# EAGLE design etch (EAGLE 9.6.2)
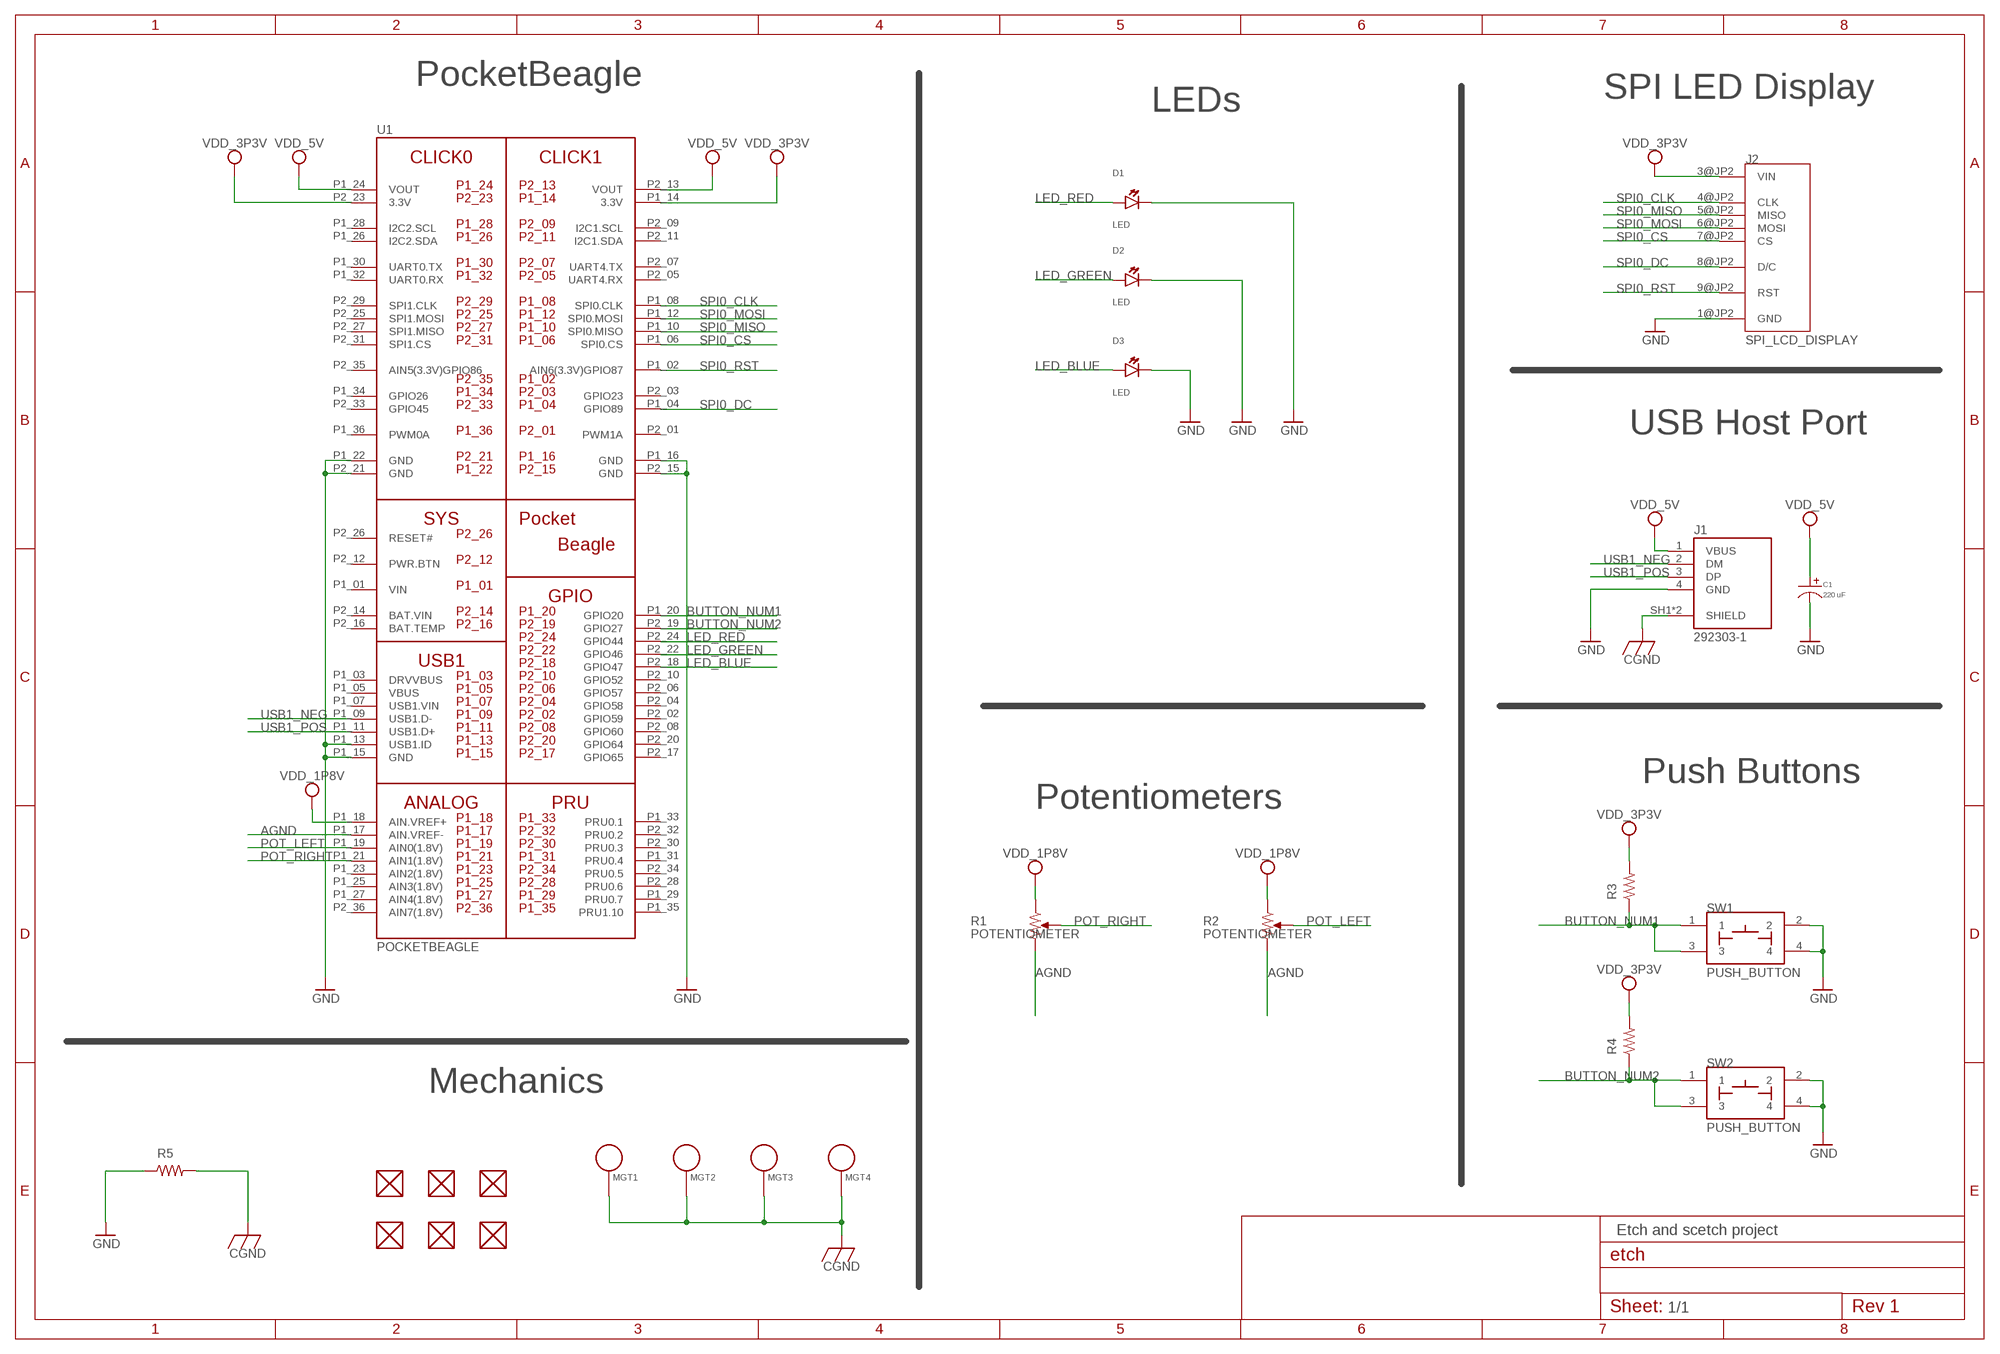
[diagram p0: schematic, sheet 1]

## Parts
C1  220 uF  CAPACITOR_P_10MM  [CP10MM]
D1  LED  [EIA-STD]
D2  LED  [EIA-STD]
D3  LED  [EIA-STD]
FUD1  FIDUCIAL  [FIDUCIAL_40MIL]
FUD2  FIDUCIAL  [FIDUCIAL_40MIL]
FUD3  FIDUCIAL  [FIDUCIAL_40MIL]
FUD4  FIDUCIAL  [FIDUCIAL_40MIL]
FUD5  FIDUCIAL  [FIDUCIAL_40MIL]
FUD6  FIDUCIAL  [FIDUCIAL_40MIL]
J1  292303-1  [TE_292303-1]
J2  SPI_LCD_DISPLAY  [TFT_LCD_PCB]
MGT1  MOUNTING_HOLE  [MOUNTING_HOLE]
MGT2  MOUNTING_HOLE  [MOUNTING_HOLE]
MGT3  MOUNTING_HOLE  [MOUNTING_HOLE]
MGT4  MOUNTING_HOLE  [MOUNTING_HOLE]
R1  POTENTIOMETER  [POT-PO90S]
R2  POTENTIOMETER  [POT-PO90S]
R3  R_R0603  [R0603]
R4  R_R0603  [R0603]
R5  R_R0603  [R0603]
SW1  PUSH_BUTTON  [BUTTON_12.5MM]
SW2  PUSH_BUTTON  [BUTTON_12.5MM]
U1  POCKETBEAGLE  [POCKETBEAGLE]

## Nets
AGND: R1.CW R2.CW U1.P1_17(AIN.VREF-)
BUTTON_NUM1: R3.1 SW1.1 SW1.3 U1.P1_20(GPIO20)
BUTTON_NUM2: R4.1 SW2.1 SW2.3 U1.P2_19(GPIO27)
CGND: J1.SH1(SHIELD) J1.SH2(SHIELD) MGT1.P$1 MGT2.P$1 MGT3.P$1 MGT4.P$1 R5.2
GND: C1.P$2 D1.CATHODE D2.CATHODE D3.CATHODE J1.4(GND) J2.1@JP2(GND) R5.1 SW1.2 SW1.4 SW2.2 SW2.4 U1.P1_13(USB1.ID) U1.P1_15(GND) U1.P1_16(GND) U1.P1_22(GND) U1.P2_15(GND) U1.P2_21(GND)
LED_BLUE: D3.ANODE U1.P2_18(GPIO47)
LED_GREEN: D2.ANODE U1.P2_22(GPIO46)
LED_RED: D1.ANODE U1.P2_24(GPIO44)
POT_LEFT: R2.S U1.P1_19(AIN0(1.8V))
POT_RIGHT: R1.S U1.P1_21(AIN1(1.8V))
SPI0_CLK: J2.4@JP2(CLK) U1.P1_08(SPI0.CLK)
SPI0_CS: J2.7@JP2(CS) U1.P1_06(SPI0.CS)
SPI0_DC: J2.8@JP2(D/C) U1.P1_04(GPIO89)
SPI0_MISO: J2.5@JP2(MISO) U1.P1_10(SPI0.MISO)
SPI0_MOSI: J2.6@JP2(MOSI) U1.P1_12(SPI0.MOSI)
SPI0_RST: J2.9@JP2(RST) U1.P1_02(AIN6(3.3V)GPIO87)
USB1_NEG: J1.2(DM) U1.P1_09(USB1.D-)
USB1_POS: J1.3(DP) U1.P1_11(USB1.D+)
VDD_1P8V: R1.CCW R2.CCW U1.P1_18(AIN.VREF+)
VDD_3P3V: J2.3@JP2(VIN) R3.2 R4.2 U1.P1_14(3.3V) U1.P2_23(3.3V)
VDD_5V: C1.P$1 J1.1(VBUS) U1.P1_24(VOUT) U1.P2_13(VOUT)
Unconnected: FUD1.P$1 FUD2.P$1 FUD3.P$1 FUD4.P$1 FUD5.P$1 FUD6.P$1 U1.P1_03(DRVVBUS) U1.P1_05(VBUS) U1.P1_07(USB1.VIN) U1.P1_23(AIN2(1.8V)) U1.P1_25(AIN3(1.8V)) U1.P1_26(I2C2.SDA) U1.P1_27(AIN4(1.8V)) U1.P1_28(I2C2.SCL) U1.P1_29(PRU0.7) U1.P1_30(UART0.TX) U1.P1_31(PRU0.4) U1.P1_32(UART0.RX) U1.P1_33(PRU0.1) U1.P1_34(GPIO26) U1.P1_35(PRU1.10) U1.P1_36(PWM0A) U1.P2_01(PWM1A) U1.P2_02(GPIO59) U1.P2_03(GPIO23) U1.P2_04(GPIO58) U1.P2_05(UART4.RX) U1.P2_06(GPIO57) U1.P2_07(UART4.TX) U1.P2_08(GPIO60) U1.P2_09(I2C1.SCL) U1.P2_10(GPIO52) U1.P2_11(I2C1.SDA) U1.P2_12(PWR.BTN) U1.P2_16(BAT.TEMP) U1.P2_17(GPIO65) U1.P2_20(GPIO64) U1.P2_25(SPI1.MOSI) U1.P2_26(RESET#) U1.P2_27(SPI1.MISO) U1.P2_28(PRU0.6) U1.P2_29(SPI1.CLK) U1.P2_30(PRU0.3) U1.P2_31(SPI1.CS) U1.P2_32(PRU0.2) U1.P2_33(GPIO45) U1.P2_34(PRU0.5) U1.P2_35(AIN5(3.3V)GPIO86) U1.P2_36(AIN7(1.8V))

## Notes on the sheet
- PocketBeagle
- SPI LED Display
- LEDs
- USB Host Port
- Push Buttons
- Potentiometers
- Mechanics
- Etch and scetch project
- 1/1

## Power pins joined to a net without a drawn wire
BAT.VIN: U1.P2_14(BAT.VIN)
VIN: U1.P1_01(VIN)

## Library data of the parts
C1 = etchpre:CAPACITOR_P: Library: MF_Passives Description: Device for Polarized Capacitors. Manufacture part number (MPN), Voltage Rating, and Tolerance can be added via Attributes. Check https://factory.macrofab.com/parts for the house parts list.; POPULATE: 1
D1-D3 = etchpre:LED: EIA-STD LED, LTST-C191TBKT
FUD1-FUD6 = etchpre:FIDUCIAL
J1 = etchpre:292303-1: CONN USB RECEPT R/A TYPE A 4POS Check availability <https://pricing.snapeda.com/parts/292303-1/TE%20Connectivity/view-part?ref=eda>; AVAILABILITY: In Stock; CENTERLINE_PITCH: 2 mm[.078 in]; COMMENT: 292303-1; DESCRIPTION: Conn; Data; USB; Recept; 2.0; 4 Pos; 1 Port; Rt Angle; A Ser; Tin over Copper; EU_ROHS_COMPLIANCE: Compliant; MF: TE Connectivity; MP: 292303-1; NUMBER_OF_POSITIONS: 4; PACKAGE: None; PRICE: None; PRODUCT_TYPE: Connector; PURCHASE-URL: https://pricing.snapeda.com/search/part/292303-1/?ref=eda
J2 = etchpre:SPI_LCD_DISPLAY
MGT1-MGT4 = etchpre:MOUNTING_HOLE: Chassis Mounting Hole w/GND connection ability
R1 R2 = etchpre:POTENTIOMETER: Potentiometer - Examples: P090S-14T20BR10K (987-1277-ND)
R3-R5 = etchpre:R_: RESISTOR, American symbol
SW1 SW2 = etchpre:PUSH_BUTTON
U1 = etchpre:POCKETBEAGLE

## Board
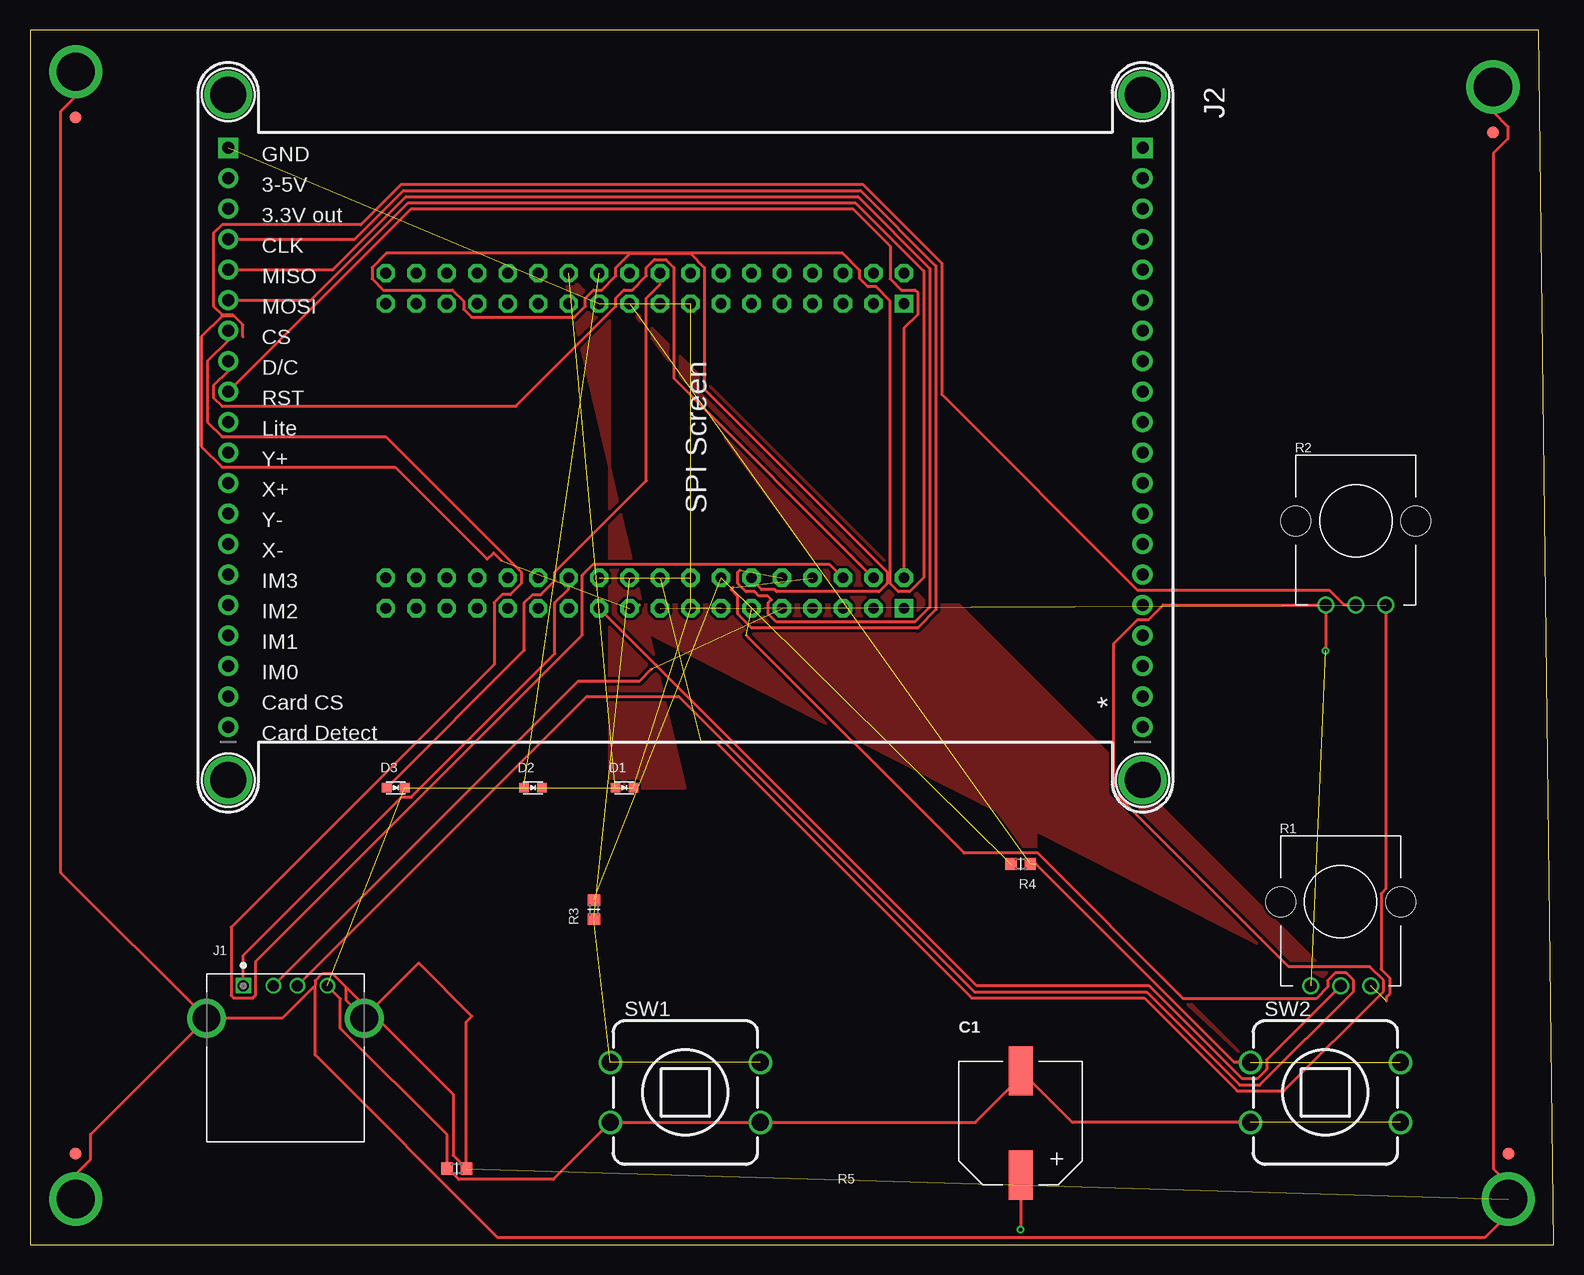
[diagram p1: board, top side]
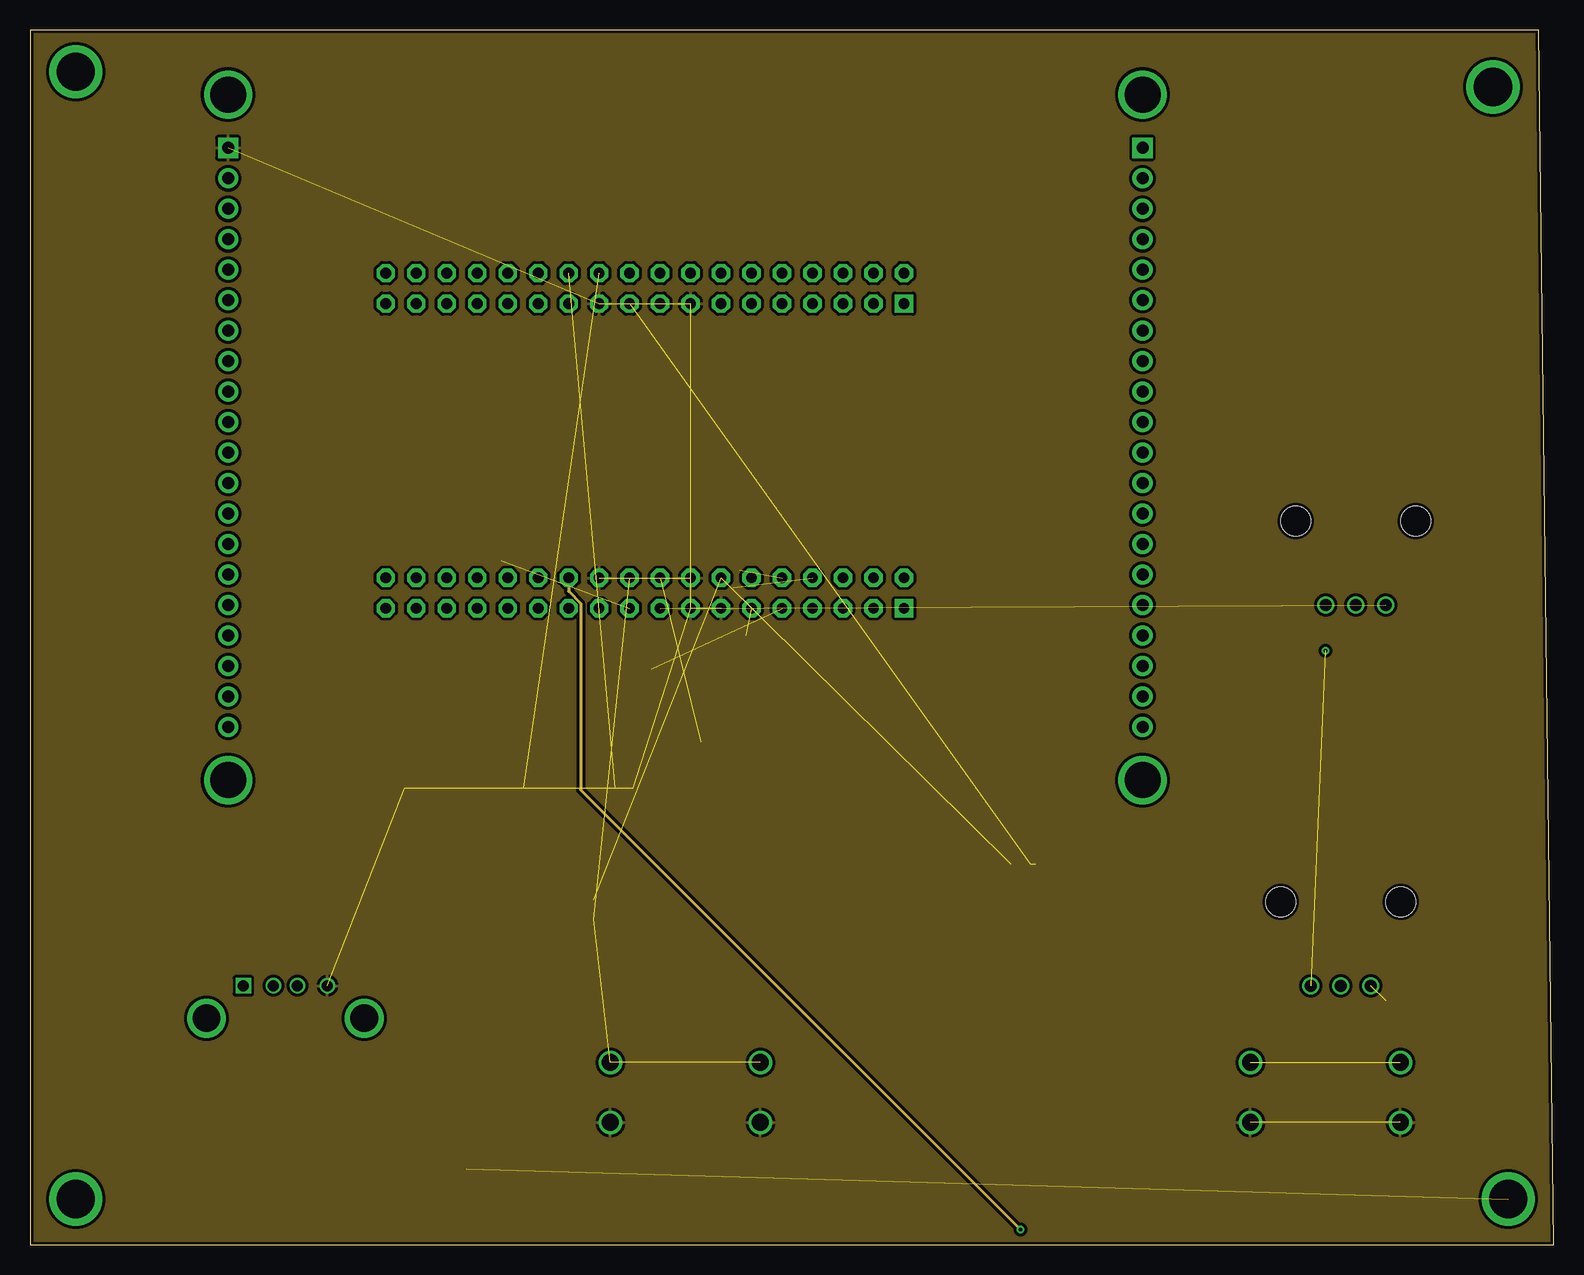
[diagram p2: board, inner layer Route2]
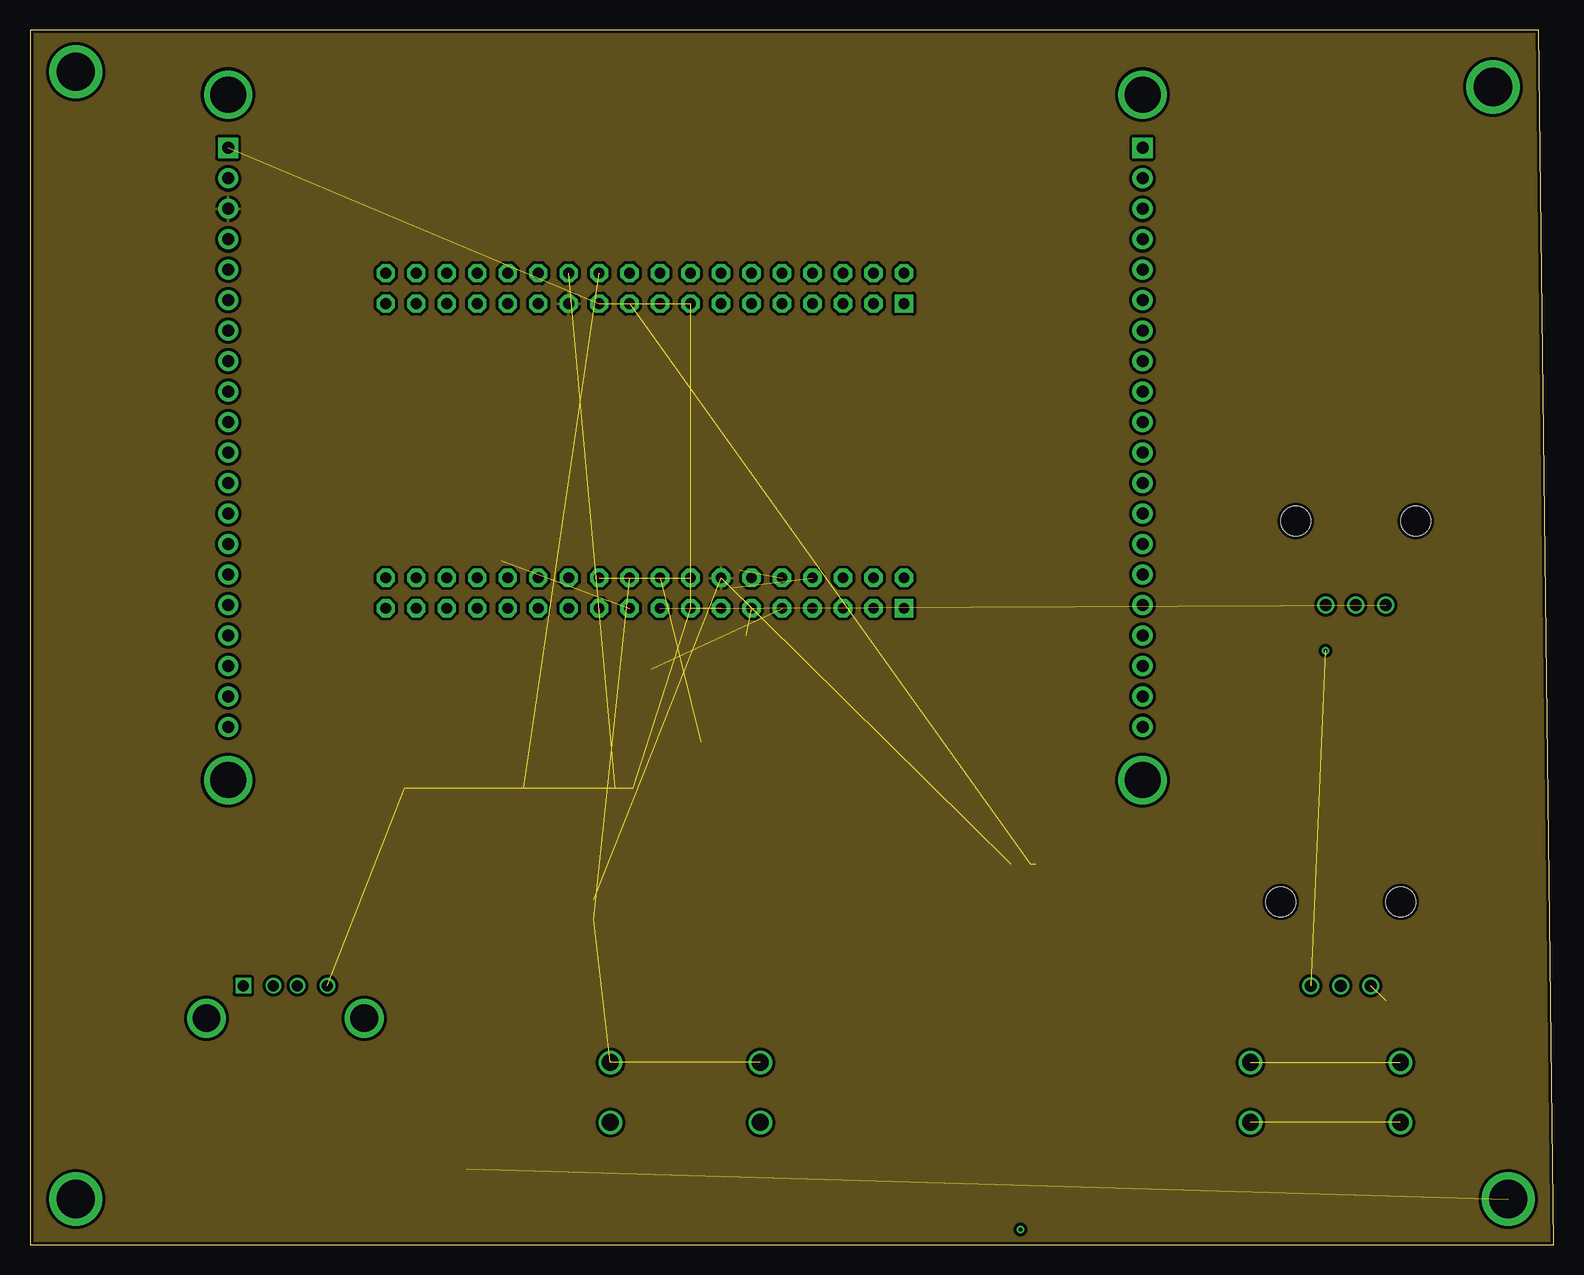
[diagram p3: board, inner layer Route15]
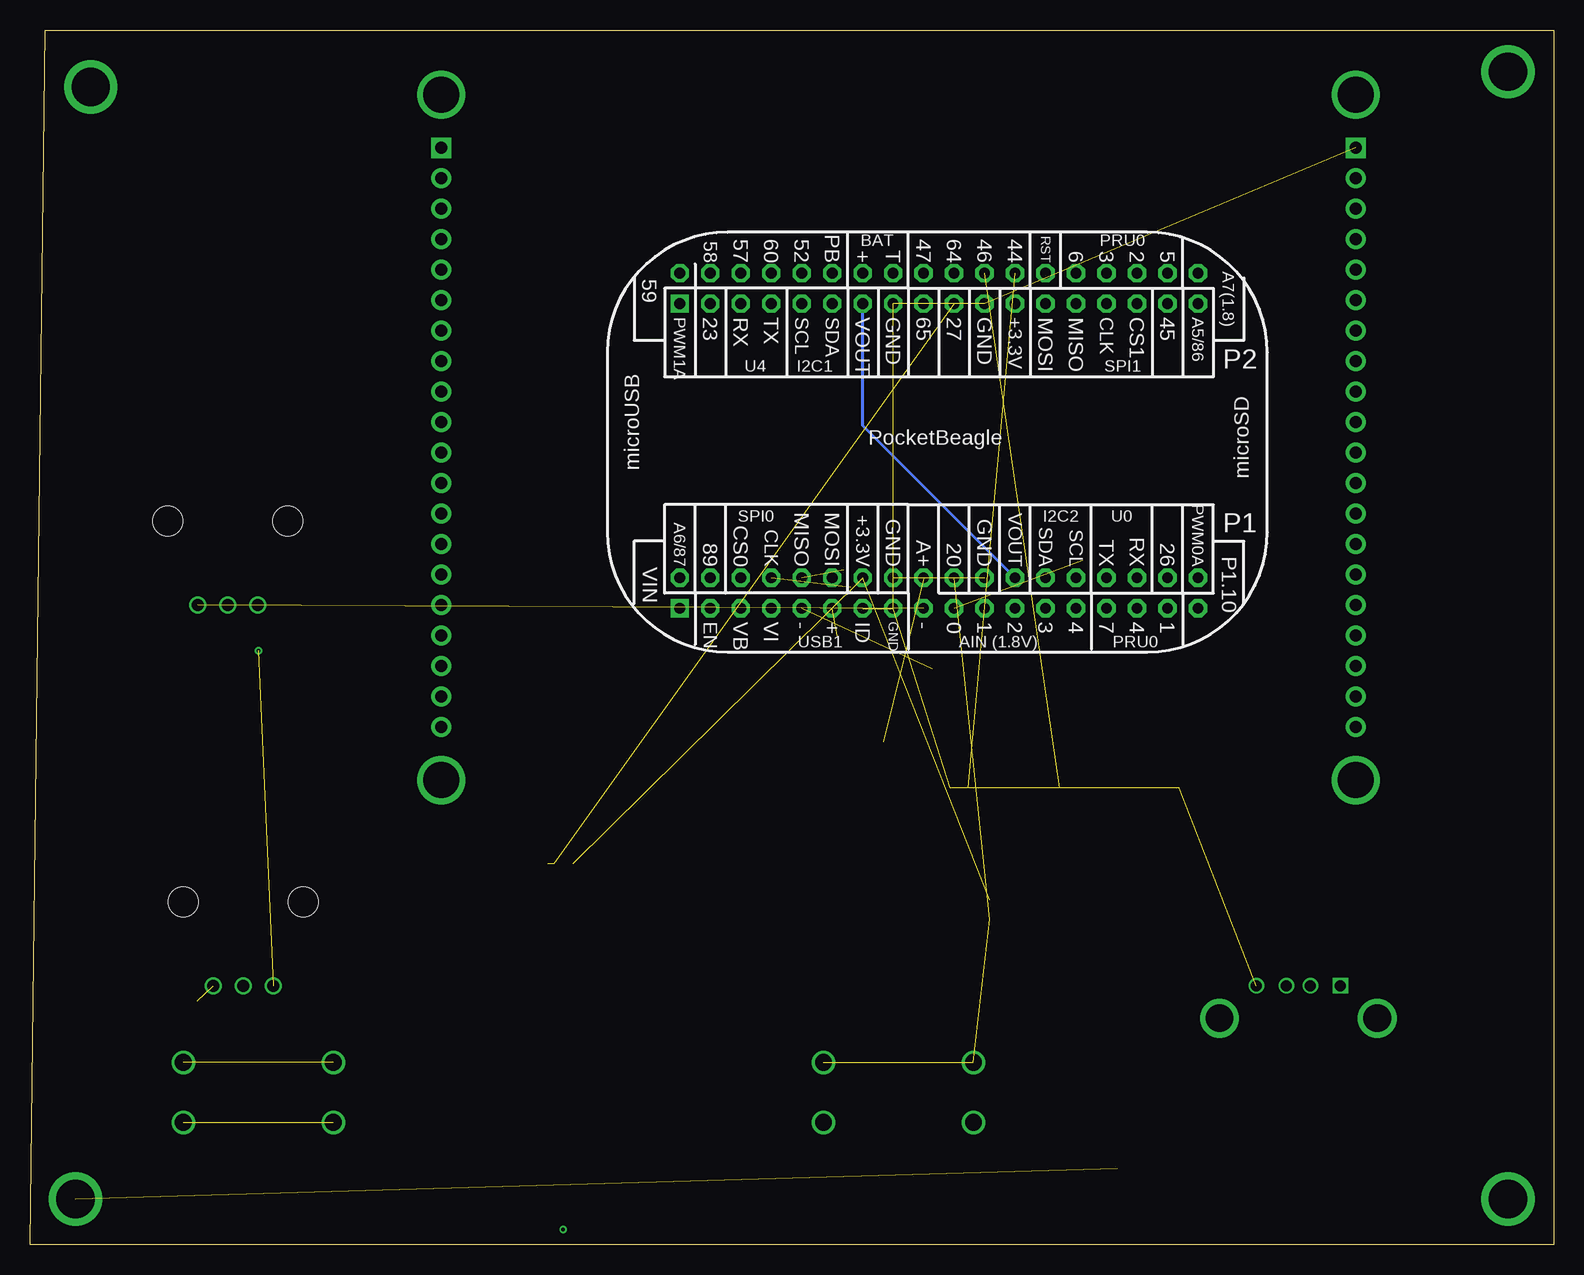
[diagram p4: board, bottom side, seen from below]

Size 126.98 x 101.27 mm. Coordinates in mm from the lower left corner, seen from the top.
Outline: 0,0 126.98,0 125.71,101.27 0,101.27 0,0
Copper layers (1*2*15*16): Top 0.035mm / dielectric 0.23mm / Route2 0.035mm / dielectric 0.93mm / Route15 0.035mm / dielectric 0.23mm / Bottom 0.035mm
Design rules "4layer": minimum track width 10mil, minimum drill 12mil, track to track 10mil, track to pad 10mil, pad to pad 10mil, via to via 10mil, smd to smd 10mil, copper to edge 10mil, drill to drill 12mil, minimum pad ring 6mil, minimum via ring 6mil, stop-mask expansion 3mil, vias tented up to drill 25mil, thermal gap 10mil

### Footprints (pad centres in the part's own frame; a part is rotated, then mirrored left to right if it is on the bottom)
CP10MM = smd 2 x 4.1: P$1 0,-4.35; P$2 0,4.35
EIA-STD = smd 0.8 x 0.8: ANODE -0.75,0; CATHODE 0.75,0
FIDUCIAL_40MIL = smd 1.016 x 1.016: P$1 0,0
TE_292303-1 = drill 0.92 square: 1 0,0 | drill 0.92: 2 2.5,0; 3 4.5,0; 4 7,0 | drill 2.3: SH1 -3.07,-2.71; SH2 10.07,-2.71
TFT_LCD_PCB = drill 1 pad 1.676 square: 1@JP1 -24.13,38.1; 1@JP2 -24.13,-38.1 | drill 1 pad 1.676: 2@JP1 -21.59,38.1; 2@JP2 -21.59,-38.1; 3@JP1 -19.05,38.1; 3@JP2 -19.05,-38.1; 4@JP1 -16.51,38.1; 4@JP2 -16.51,-38.1; 5@JP1 -13.97,38.1; 5@JP2 -13.97,-38.1; 6@JP1 -11.43,38.1; 6@JP2 -11.43,-38.1; 7@JP1 -8.89,38.1; 7@JP2 -8.89,-38.1; 8@JP1 -6.35,38.1; 8@JP2 -6.35,-38.1; 9@JP1 -3.81,38.1; 9@JP2 -3.81,-38.1; 10@JP1 -1.27,38.1; 10@JP2 -1.27,-38.1; 11@JP1 1.27,38.1; 11@JP2 1.27,-38.1; 12@JP1 3.81,38.1; 12@JP2 3.81,-38.1; 13@JP1 6.35,38.1; 13@JP2 6.35,-38.1; 14@JP1 8.89,38.1; 14@JP2 8.89,-38.1; 15@JP1 11.43,38.1; 15@JP2 11.43,-38.1; 16@JP1 13.97,38.1; 16@JP2 13.97,-38.1; 17@JP1 16.51,38.1; 17@JP2 16.51,-38.1; 18@JP1 19.05,38.1; 18@JP2 19.05,-38.1; 19@JP1 21.59,38.1; 19@JP2 21.59,-38.1; 20@JP1 24.13,38.1; 20@JP2 24.13,-38.1 | drill 3 pad 3.6: P$1@U$7 -28.575,-38.1; P$1@U$15 28.575,-38.1; P$1@U$16 -28.575,38.1; P$1@U$17 28.575,38.1
MOUNTING_HOLE = drill 3.175 pad 4.445: P$1 0,0
POT-PO90S = drill 1: CCW -2.5,0; CW 2.5,0; S 0,0 | hole 2.5: -5,7; 5,7
R0603 = smd 0.95 x 1.031: 1 -0.8,0; 2 0.8,0
BUTTON_12.5MM = drill 1.4: 1 -6.25,2.5; 2 -6.25,-2.5; 3 6.25,2.5; 4 6.25,-2.5
POCKETBEAGLE = drill 0.889 pad 1.524 square: P1_01 5.91,3.53; P2_01 5.91,28.93 | drill 0.889 pad 1.524 octagon: P1_02 5.91,6.07; P1_03 8.45,3.53; P1_04 8.45,6.07; P1_05 10.99,3.53; P1_06 10.99,6.07; P1_07 13.53,3.53; P1_08 13.53,6.07; P1_09 16.07,3.53; P1_10 16.07,6.07; P1_11 18.61,3.53; P1_12 18.61,6.07; P1_13 21.15,3.53; P1_14 21.15,6.07; P1_15 23.69,3.53; P1_16 23.69,6.07; P1_17 26.23,3.53; P1_18 26.23,6.07; P1_19 28.77,3.53; P1_20 28.77,6.07; P1_21 31.31,3.53; P1_22 31.31,6.07; P1_23 33.85,3.53; P1_24 33.85,6.07; P1_25 36.39,3.53; P1_26 36.39,6.07; P1_27 38.93,3.53; P1_28 38.93,6.07; P1_29 41.47,3.53; P1_30 41.47,6.07; P1_31 44.01,3.53; P1_32 44.01,6.07; P1_33 46.55,3.53; P1_34 46.55,6.07; P1_35 49.09,3.53; P1_36 49.09,6.07; P2_02 5.91,31.47; P2_03 8.45,28.93; P2_04 8.45,31.47; P2_05 10.99,28.93; P2_06 10.99,31.47; P2_07 13.53,28.93; P2_08 13.53,31.47; P2_09 16.07,28.93; P2_10 16.07,31.47; P2_11 18.61,28.93; P2_12 18.61,31.47; P2_13 21.15,28.93; P2_14 21.15,31.47; P2_15 23.69,28.93; P2_16 23.69,31.47; P2_17 26.23,28.93; P2_18 26.23,31.47; P2_19 28.77,28.93; P2_20 28.77,31.47; P2_21 31.31,28.93; P2_22 31.31,31.47; P2_23 33.85,28.93; P2_24 33.85,31.47; P2_25 36.39,28.93; P2_26 36.39,31.47; P2_27 38.93,28.93; P2_28 38.93,31.47; P2_29 41.47,28.93; P2_30 41.47,31.47; P2_31 44.01,28.93; P2_32 44.01,31.47; P2_33 46.55,28.93; P2_34 46.55,31.47; P2_35 49.09,28.93; P2_36 49.09,31.47

### Placement (x,y rotation side)
C1  82.55,10.16 0 top
D1  49.53,38.1 0 top
D2  41.91,38.1 0 top
D3  30.48,38.1 0 top
FUD1  121.92,92.71 0 top
FUD2  3.81,7.62 0 top
FUD3  123.19,7.62 0 top
FUD4  -26.67,147.32 0 top  (outside the outline)
FUD5  -29.21,147.32 0 top  (outside the outline)
FUD6  3.81,93.98 0 top
J1  17.78,21.59 0 top
J2  54.61,67.31 270 top
MGT1  121.92,96.52 0 top
MGT2  123.19,3.81 0 top
MGT3  3.81,3.81 0 top
MGT4  3.81,97.79 0 top
R1  109.22,21.59 0 top
R2  110.49,53.34 0 top
R3  46.99,27.94 90 top
R4  82.55,31.75 180 top
R5  35.56,6.35 0 top
SW1  54.61,12.7 0 top
SW2  107.95,12.7 0 top
U1  78.74,49.53 0 bottom

### Tracks (layer width: path | path; a pad name or v marks a point on that pad's centre or on a via)
1
  pour Top: 49.53,78.74 83.82,44.45 83.82,31.75
AGND  (2 unrouted)
  Top 0.254: R2.CW 112.99,29.67 112.59,29.27 112.59,22.97 113.31,22.25 113.31,20.93 113.03,20.65 113.03,20.32
BUTTON
  pour Top: 101.6,15.24 85.09,31.75 83.82,31.75
BUTTON_NUM1  (3 unrouted)
BUTTON_NUM2  (3 unrouted)
  Top 0.254: SW2.1 100.37,15.2 83.82,31.75
BUTTONLEFT
  pour Top: 109.22,21.59 77.47,53.34 46.99,53.34
CGND  (1 unrouted)
  Top 0.254: 26.37,21.45 26.37,20.36 J1.SH2 27.85,18.96 32.38,23.5 36.83,19.05 36.36,18.58 R5.2 35.27,7.44 35.27,12.55 26.37,21.45 | 23.75,21.61 23.75,22.02 24.36,22.61 25.2,22.61 26.37,21.45 | 23.75,21.61 21.02,18.88 J1.SH1 | MGT3.P$1 3.81,5.87 5.05,7.11 5.05,9.22 J1.SH1 | MGT4.P$1 3.81,95.73 2.57,94.49 2.57,31.02 J1.SH1 | MGT1.P$1 121.92,94.46 123.16,93.22 123.16,92.2 121.95,90.99 121.95,6.32 124.46,3.81 121.23,0.58 39,0.58 23.75,15.82 23.75,21.61
GND  (11 unrouted)
  Top 0.254: SW2.2 86.86,10.2 82.82,14.24 | 82.82,14.24 C1.P$2 | 82.82,14.24 78.78,10.2 SW1.4 SW1.2 43.61,5.45 35.73,5.45 34.83,6.35 R5.1 34.76,9.15 25.86,18.05 25.86,20.51 J1.4
  pour Route2: -5.08,106.68 -5.08,-5.08 132.08,-5.08 132.08,106.68
LED_BLUE
  Top 0.254: U1.P2_18 52.51,80.08 51.37,78.93 51.37,63.69 43.75,56.07 43.75,55.38 42.57,54.2 41.88,54.2 41.21,53.53 41.21,49.58 D3.ANODE
LED_GREEN  (1 unrouted)
LED_RED  (1 unrouted)
N$1
  pour Top: 44.45,81.28 48.26,77.47 48.26,38.1 54.61,38.1
POT_LEFT  (1 unrouted)
  Top 0.254: 17.02,77.42 17.73,76.7 17.73,75.69 | 17.02,77.42 16,77.42 14.28,75.69 14.28,66.55 16,64.82 30.43,64.82 38.1,57.15 38.63,57.68 39.26,57.04 | R2.S 109.52,53.34 108.3,54.56 92.31,54.56 76,70.86 76,81.81 69.42,88.39 30.91,88.39 27.55,85.04 16,85.04 15.29,84.33 15.29,78.23 16,77.52 16.91,77.52 17.02,77.42 | 17.73,75.69 | U1.P1_19 50.25,53.34 50.8,53.34 50.52,53.06 U1.P1_19
POT_RIGHT
  Top 0.254: U1.P1_21 52.15,48.34 78.9,21.59 93.26,21.59 101.01,13.84 102.26,13.84 103.06,14.64 103.06,15.43 R1.S
SPI0_CLK  (1 unrouted)
  Top 0.254: J2.4@JP2 27.05,83.82 31.12,87.88 69.21,87.88 75.5,81.6 75.5,52.95 73.96,51.41 60.16,51.41 58.99,52.59 58.99,54.04 58.42,54.61 58.6,54.79
SPI0_CS
  Top 0.254: U1.P1_06 66.61,56.74 46.96,56.74 46.03,55.82 46.03,50.85 18.8,23.62 18.8,20.79 18.58,20.57 16.98,20.57 16.75,20.79 16.75,26.46 38.67,48.38 38.67,53.53 39.34,54.2 40.03,54.2 40.95,55.13 40.95,56.07 29.67,67.36 16,67.36 14.78,68.58 14.78,73.66 16.51,75.38 J2.7@JP2
SPI0_DC
  Top 0.254: J2.8@JP2 16.51,72.84 15.29,71.62 15.29,70.61 16,69.9 40.49,69.9 48.83,78.24 48.83,78.93 49.5,79.6 50.19,79.6 51.37,80.78 51.37,81.47 52.04,82.14 52.98,82.14 53.65,81.47 53.65,72.24 U1.P1_04
SPI0_MISO  (1 unrouted)
  Top 0.254: 59.15,56.23 58.99,56.07 58.99,55.13 59.66,54.46 60.4,54.46 60.75,54.1 61.47,54.1 61.78,53.79 61.53,53.53 61.53,52.59 62.2,51.92 73.75,51.92 74.99,53.16 74.99,81.39 69,87.38 31.33,87.38 25.23,81.28 J2.5@JP2
SPI0_MOSI
  Top 0.254: J2.6@JP2 23.41,78.74 31.54,86.87 68.79,86.87 74.48,81.18 74.48,55.63 73.3,54.46 72.36,54.46 71.69,55.13 71.69,78.68 70.51,79.86 69.82,79.86 69.15,80.53 69.15,81.22 67.72,82.65 29.68,82.65 28.51,81.47 28.51,80.53 29.43,79.6 35.2,79.6 36.13,78.68 36.13,77.99 36.8,77.32 45.36,77.32 46.29,78.24 46.29,78.93 46.96,79.6 47.65,79.6 48.83,80.78 48.83,81.47 50.01,82.65 55.02,82.65 56.19,81.47 56.19,71.31 71.43,56.07 71.43,55.13 70.76,54.46 62.2,54.46 62.04,54.61 60.96,54.61 60.13,55.44 U1.P1_12
SPI0_RST
  Top 0.254: J2.9@JP2 31.75,86.36 68.58,86.36 71.69,83.25 71.69,80.53 72.61,79.6 73.75,79.6 73.97,79.38 73.97,77.54 72.83,76.4 U1.P1_02
USB1_NEG  (1 unrouted)
  Top 0.254: J1.2 45.68,46.99 50.8,46.99 51.79,47.98
USB1_POS  (1 unrouted)
  Top 0.254: J1.3 46.41,45.72 54.05,45.72 78.69,21.08 93.05,21.08 100.8,13.33 102.49,13.33 110.3,21.14 110.3,22.04 109.67,22.67 108.77,22.67 108.14,22.04 108.14,21.48 107.17,20.51 96.12,20.51 83.98,32.65 77.84,32.65 59.69,50.8
VDD_1P8V  (via drill 0.3)  (2 unrouted)
  Top 0.254: v107.95,49.53 107.99,49.57 R2.CCW 94.43,53.34 93.22,52.12 92.31,52.12 90.32,50.13 90.32,37.74 104.89,23.18 111.66,23.18 112.8,22.04 112.8,21.14 104.48,12.82 100.59,12.82 92.84,20.57 78.48,20.57 57.14,41.91 55.88,41.91
VDD_3P3V  (2 unrouted)
  pour Route15: -7.62,109.22 -7.62,-7.62 134.62,-7.62 134.62,109.22
VDD_5V  (via drill 0.3)
  Top 0.254: C1.P$1 v82.55,1.27 | J1.1 17.78,24.13 30.97,37.32 31.79,37.32 43.75,49.28 43.75,53.53 44.89,54.68 U1.P1_24
  Route2 0.254: U1.P1_24 44.89,54.48 45.89,53.48 45.89,37.93 v82.55,1.27
  Bottom 0.254: U1.P1_24 57.59,68.3 U1.P2_13